# Altium schematic sheet HomeAlarm - M31 Interface board.SchDoc: M31 Interface board
size A4; SheetNumber: 1; Version: 1.0; Variant: Variant; Modification: Mod; Project: Home Alarm System
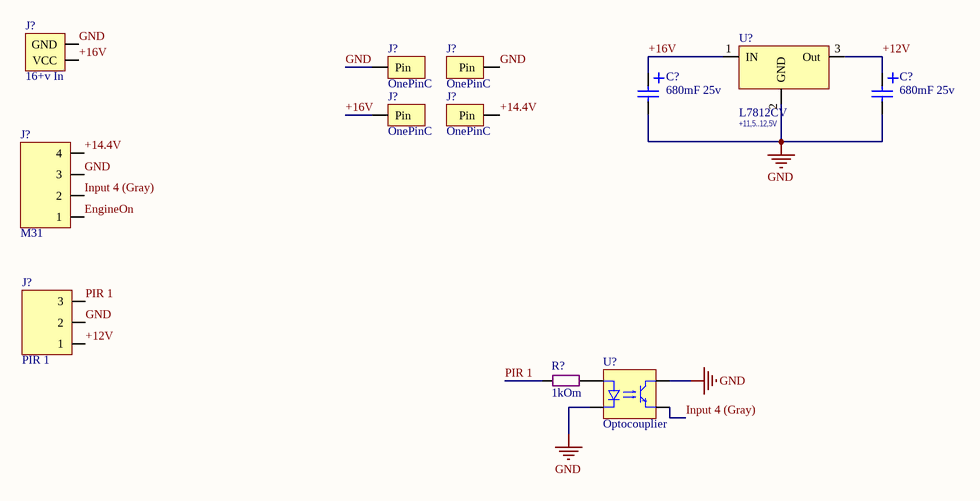
[diagram p0: HomeAlarm - M31 Interface board.SchDoc]

## Parts
(Parts that share a designator on the sheet are numbered #1, #2 ... from top to bottom, then left to right.)
C?#1  680mF 25v  [Cap E p5.08mm D10.2mm (3p)]
C?#2  680mF 25v  [Cap E p5.08mm D10.2mm (3p)]
J?#1  16+v In  [DC Connector]
J?#2  OnePinC  [OnePin 1x2.5]
J?#3  OnePinC  [OnePin 1x2.5]
J?#4  OnePinC  [OnePin 1x2.5]
J?#5  OnePinC  [OnePin 1x2.5]
J?#6  M31  [Line 2.54 X 4]
J?#7  PIR 1  [Line 2.54 X 3]
R?  1kOm  [Res p7.62 (4p) 0.25w]
U?#1  L7812CV  V Out: +11,5..12,5V  [TO220-2]
U?#2  Optocouplier  [DIP-4]

## Nets
GND: C?#1.2 C?#2.2 J?#1.GND J?#2.1(Pin) J?#3.1(Pin) J?#6.3 J?#7.2 U?#1.2(GND) U?#2.2 U?#2.3
+12V: C?#2.1 J?#7.1 U?#1.3(Out)
+14.4V: J?#5.1(Pin) J?#6.4
+16V: C?#1.1 J?#1.VCC J?#4.1(Pin) U?#1.1(IN)
EngineOn: J?#6.1
Input 4 (Gray): J?#6.2 U?#2.4
PIR 1: J?#7.3 R?.1
NetR?_2: R?.2 U?#2.1

## Notes on the sheet
- Ver:
- Rev:
- Sheet
- of
- File:

## Library data of the parts
C?#1 C?#2 = Cap E 1000mF x 25V: Capacitor
J?#1 = DC Connector (PJ-002B): DC Connector; Ext Pin Diameter: 5.5mm; Int Pin Diameter: 2.5
J?#2-J?#5 = OnePin Connector: Only pad
J?#6 = PLS-4: Vert, Sgl line, Male
J?#7 = PLS-3: Vert, Sgl line, Male
R? = Res All Types
U?#1 = L7812CV: Voltage Regulator; Manufacturer: ST; I output (A): 1.5; Max Voltage In (V): 35; t: 0...+150°C; Dropuot: 2V; Case: TO220; Name: L7812CV; Dtatsheet: http://tec.org.ru/board/0-0-0-1633-20
U?#2 = Optocouplier LTV 817B: LTV817 Datasheet: http://lib.chipdip.ru/222/DOC000222300.pdf; Name: LTV817B